# Altium schematic sheet Sheet1.SchDoc
size A4; SheetNumber: 1; SheetTotal: 1
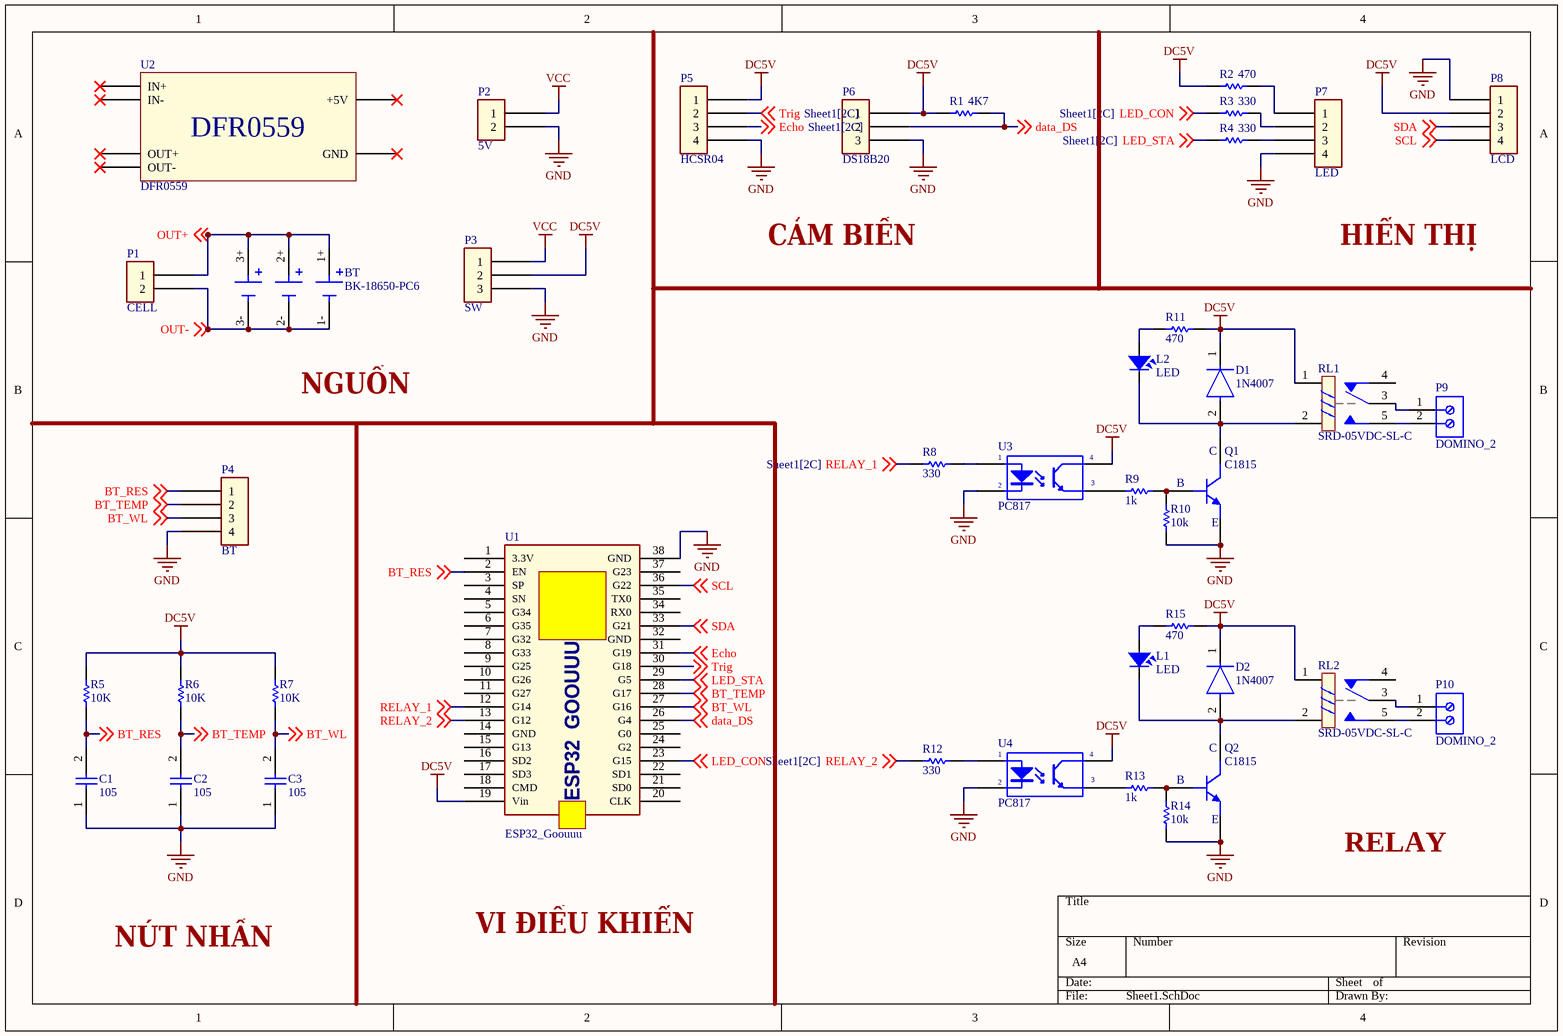
[diagram p0: Sheet1.SchDoc]

## Parts
BT  BK-18650-PC6  [BAT_BK-18650-PC6]
C1  105  [CAP_CER_105]
C2  105  [CAP_CER_105]
C3  105  [CAP_CER_105]
D1  1N4007  [DO-41]
D2  1N4007  [DO-41]
L1  LED  [LED-5-RED]
L2  LED  [LED-5-RED]
P1  CELL  [CON2]
P2  5V  [CON2]
P3  SW  [CON3]
P4  BT  [CON4]
P5  HCSR04  [CON4]
P6  DS18B20  [CON3]
P7  LED  [CON4]
P8  LCD  [CON4]
P9  DOMINO_2  [DOMINO_2]
P10  DOMINO_2  [DOMINO_2]
Q1  C1815  [QTO-92]
Q2  C1815  [QTO-92]
R1  value 4K7  [R1/4W]  (hidden comment: RES)
R2  value 470  [R1/4W]  (hidden comment: RES)
R3  value 330  [R1/4W]  (hidden comment: RES)
R4  value 330  [R1/4W]  (hidden comment: RES)
R5  value 10K  [R1/4W]  (hidden comment: RES)
R6  value 10K  [R1/4W]  (hidden comment: RES)
R7  value 10K  [R1/4W]  (hidden comment: RES)
R8  value 330  [R1/4W]  (hidden comment: RES)
R9  value 1k  [R1/4W]  (hidden comment: RES)
R10  value 10k  [R1/4W]  (hidden comment: RES)
R11  value 470  [R1/4W]  (hidden comment: RES)
R12  value 330  [R1/4W]  (hidden comment: RES)
R13  value 1k  [R1/4W]  (hidden comment: RES)
R14  value 10k  [R1/4W]  (hidden comment: RES)
R15  value 470  [R1/4W]  (hidden comment: RES)
RL1  SRD-05VDC-SL-C  [SRD-05VDC-SL-C]
RL2  SRD-05VDC-SL-C  [SRD-05VDC-SL-C]
U1  ESP32_Goouuu  [ESP32_Goouuu]
U2  DFR0559  [DFR0559]
U3  PC817  [PC817-DIP4]
U4  PC817  [PC817-DIP4]

## Nets
DC5V: D1.1(C) D2.1(C) P3.2 P5.1 P6.1 P8.2 R1.2 R2.2 R5.1 R6.1 R7.1 R11.2 R15.2 RL1.1 RL2.1 U1.19(Vin) U3.4(C) U4.4(C)
GND: C1.1 C2.1 C3.1 P2.2 P3.3 P4.4 P5.4 P6.3 P7.4 P8.1 Q1.1(E) Q2.1(E) R10.1 R14.1 U1.38(GND) U3.2(K) U4.2(K)
VCC: P2.1 P3.1
BT_RES: C1.2 P4.1 R5.2 U1.2(EN) ; off-sheet BT_RES
BT_TEMP: C2.2 P4.2 R6.2 U1.28(G17) ; off-sheet BT_TEMP
BT_WL: C3.2 P4.3 R7.2 U1.27(G16) ; off-sheet BT_WL
data_DS: P6.2 R1.1 U1.26(G4) ; off-sheet data_DS
Echo: P5.3 U1.31(G19) ; off-sheet Echo
LED_CON: R3.2 U1.23(G15) ; off-sheet LED_CON
LED_STA: R4.2 U1.29(G5) ; off-sheet LED_STA
OUT+: BT.1+ BT.2+ BT.3+ P1.1 ; off-sheet OUT+
OUT-: BT.1- BT.2- BT.3- P1.2 ; off-sheet OUT-
RELAY_1: R8.1 U1.12(G14) ; off-sheet RELAY_1
RELAY_2: R12.1 U1.13(G12) ; off-sheet RELAY_2
SCL: P8.4 U1.36(G22) ; off-sheet SCL
SDA: P8.3 U1.33(G21) ; off-sheet SDA
Trig: P5.2 U1.30(G18) ; off-sheet Trig
NetD1_2: D1.2(A) L2.2 Q1.2(C) RL1.2
NetD2_2: D2.2(A) L1.2 Q2.2(C) RL2.2
NetL1_1: L1.1 R15.1
NetL2_1: L2.1 R11.1
NetP7_1: P7.1 R2.1
NetP7_2: P7.2 R3.1
NetP7_3: P7.3 R4.1
NetP9_1: P9.1 RL1.3
NetP9_2: P9.2 RL1.5
NetP10_1: P10.1 RL2.3
NetP10_2: P10.2 RL2.5
NetQ1_3: Q1.3(B) R9.2 R10.2
NetQ2_3: Q2.3(B) R13.2 R14.2
NetR8_2: R8.2 U3.1(A)
NetR9_1: R9.1 U3.3(E)
NetR12_2: R12.2 U4.1(A)
NetR13_1: R13.1 U4.3(E)

Not connected (* = marked no-connect by the designer): RL1 4; RL2 4; U1 1(3.3V) 3(SP) 4(SN) 5(G34) 6(G35) 7(G32) 8(G33) 9(G25) 10(G26) 11(G27) 14(GND) 15(G13) 16(SD2) 17(SD3) 18(CMD) 20(CLK) 21(SD0) 22(SD1) 24(G2) 25(G0) 32(GND) 34(RX0) 35(TX0) 37(G23); U2 1(IN+)* 2(IN-)* 3(GND)* 4(+5V)*

## Notes on the sheet
- CẢM BIẾN
- HIỂN THỊ
- NGUỒN
- RELAY
- VI ĐIỀU KHIỂN
- NÚT NHẤN
- (in symbol ESP32_Goouuu) ESP32  GOOUUU

## Library data of the parts
BT = BK-18650-PC6: Battery Holder _Open_ 18650 3 Cell PC Pin; MF: MPD; Price: None; Package: None; Availability: Unavailable; SnapEDA_Link: https://www.snapeda.com/parts/BK-18650-PC6/MPD/view-part/4480464/?ref=snap; Value: *; MP: BK-18650-PC6
C1-C3 = CAP_CER_105: Capacitor Ceramic 105 1uF; Value: *
D1 D2 = 1N4007: Diode 1N4007 DO-41, 1000V, 1.00A; Manufacturer: Diotec; Max Surge Current: 27A; Peak Non-Repetitive Surge Current: 30A; Forward Voltage: 1V; Element Configuration: Single; Polarity: Standard; Supplier: Mouser; Supplier Part Number: 637-1N4007; Manufacturer Part Number: 1N4007; RoHS: Yes; Category: Rectifier Diodes; Stock: 171929; Pricing: 1=0,40000, 10=0,13200, 50=0,13200, 100=0,09500, 500=0,06900, 1000=0,06600, 2500=0,06100, 5000=0,05200, 10000=0,04700 (USD); Mounting Technology: Through Hole; Pins: 2; Min Operating Temperature: -50°C; Max Operating Temperature: 175°C; Packaging: Ammo Pack; RoHS Compliant: Yes; ComponentLink1URL: https://datasheet.ciiva.com/26325/162272-da-01-ml-1n4007-silizium-diode-de-en-26325271.pdf?src-supplier=Conrad; ComponentLink1Description: https://datasheet.ciiva.com/26325/162272-da-01-ml-1n4007-silizium-diode-de-en-26325271.pdf?src-supplier=Conrad; ComponentLink2URL: https://datasheet.ciiva.com/48433/1n400x-eng-tds-48433165.pdf?src-supplier=Distrelec; ComponentLink2Description: https://datasheet.ciiva.com/48433/1n400x-eng-tds-48433165.pdf?src-supplier=Distrelec
P1 P2 = CON2: Connector 2
P3 P6 = CON3: Connector 3
P4 P5 P7 P8 = CON4: Connector 4
P9 P10 = DOMINO_2: Domino 2
Q1 Q2 = C1815: NPN 600mW, ECB; Value: C1815
R1-R15 = RES_1K_1/4W: Resistor Through-Hole  1K 1/4W
U3 U4 = PC817 DIP: PC817 DIP Single Opto; Value: PC817